# Altium schematic sheet Sheet3.SchDoc
size A4 portrait
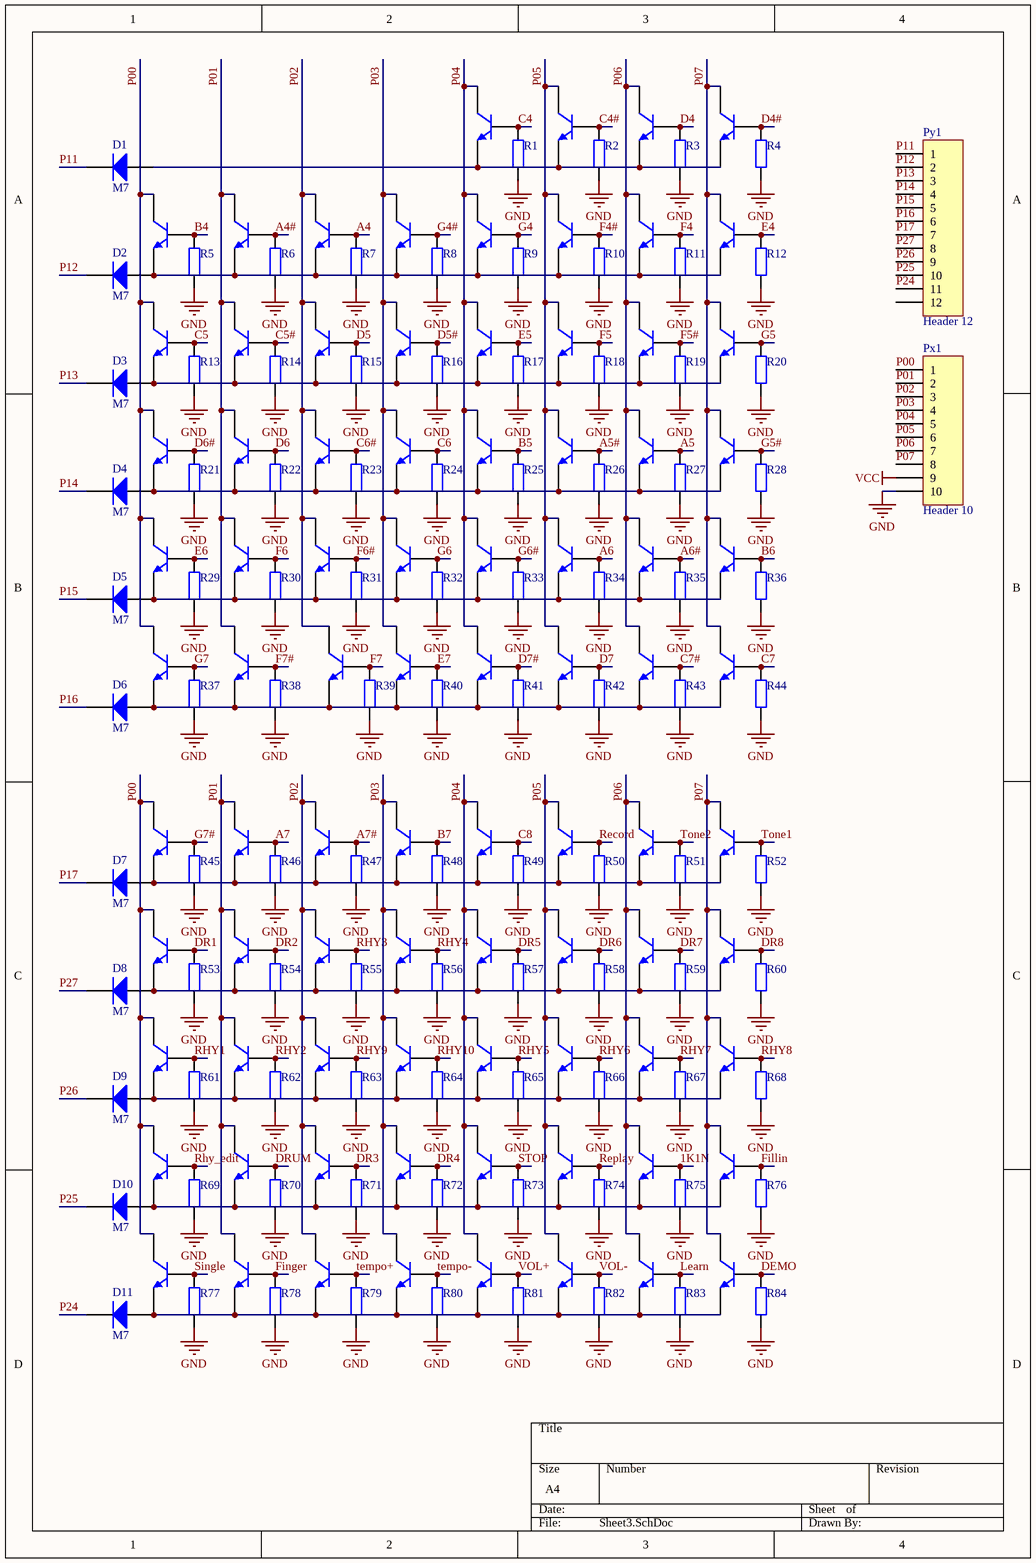
[diagram p0: Sheet3.SchDoc]

## Parts
D1  M7  [SMA(DO-214AC)_S1]
D2  M7  [SMA(DO-214AC)_S1]
D3  M7  [SMA(DO-214AC)_S1]
D4  M7  [SMA(DO-214AC)_S1]
D5  M7  [SMA(DO-214AC)_S1]
D6  M7  [SMA(DO-214AC)_S1]
D7  M7  [SMA(DO-214AC)_S1]
D8  M7  [SMA(DO-214AC)_S1]
D9  M7  [SMA(DO-214AC)_S1]
D10  M7  [SMA(DO-214AC)_S1]
D11  M7  [SMA(DO-214AC)_S1]
Px1  Header 10  [FPC1.0-2H-WS-10P]
Py1  Header 12  [FPC1.0-2H-WS-12P]
Q1  SS8050 Y1  [SOT-23(SOT-23-3)]  (value not drawn)
Q2  SS8050 Y1  [SOT-23(SOT-23-3)]  (value not drawn)
Q3  SS8050 Y1  [SOT-23(SOT-23-3)]  (value not drawn)
Q4  SS8050 Y1  [SOT-23(SOT-23-3)]  (value not drawn)
Q5  SS8050 Y1  [SOT-23(SOT-23-3)]  (value not drawn)
Q6  SS8050 Y1  [SOT-23(SOT-23-3)]  (value not drawn)
Q7  SS8050 Y1  [SOT-23(SOT-23-3)]  (value not drawn)
Q8  SS8050 Y1  [SOT-23(SOT-23-3)]  (value not drawn)
Q9  SS8050 Y1  [SOT-23(SOT-23-3)]  (value not drawn)
Q10  SS8050 Y1  [SOT-23(SOT-23-3)]  (value not drawn)
Q11  SS8050 Y1  [SOT-23(SOT-23-3)]  (value not drawn)
Q12  SS8050 Y1  [SOT-23(SOT-23-3)]  (value not drawn)
Q13  SS8050 Y1  [SOT-23(SOT-23-3)]  (value not drawn)
Q14  SS8050 Y1  [SOT-23(SOT-23-3)]  (value not drawn)
Q15  SS8050 Y1  [SOT-23(SOT-23-3)]  (value not drawn)
Q16  SS8050 Y1  [SOT-23(SOT-23-3)]  (value not drawn)
Q17  SS8050 Y1  [SOT-23(SOT-23-3)]  (value not drawn)
Q18  SS8050 Y1  [SOT-23(SOT-23-3)]  (value not drawn)
Q19  SS8050 Y1  [SOT-23(SOT-23-3)]  (value not drawn)
Q20  SS8050 Y1  [SOT-23(SOT-23-3)]  (value not drawn)
Q21  SS8050 Y1  [SOT-23(SOT-23-3)]  (value not drawn)
Q22  SS8050 Y1  [SOT-23(SOT-23-3)]  (value not drawn)
Q23  SS8050 Y1  [SOT-23(SOT-23-3)]  (value not drawn)
Q24  SS8050 Y1  [SOT-23(SOT-23-3)]  (value not drawn)
Q25  SS8050 Y1  [SOT-23(SOT-23-3)]  (value not drawn)
Q26  SS8050 Y1  [SOT-23(SOT-23-3)]  (value not drawn)
Q27  SS8050 Y1  [SOT-23(SOT-23-3)]  (value not drawn)
Q28  SS8050 Y1  [SOT-23(SOT-23-3)]  (value not drawn)
Q29  SS8050 Y1  [SOT-23(SOT-23-3)]  (value not drawn)
Q30  SS8050 Y1  [SOT-23(SOT-23-3)]  (value not drawn)
Q31  SS8050 Y1  [SOT-23(SOT-23-3)]  (value not drawn)
Q32  SS8050 Y1  [SOT-23(SOT-23-3)]  (value not drawn)
Q33  SS8050 Y1  [SOT-23(SOT-23-3)]  (value not drawn)
Q34  SS8050 Y1  [SOT-23(SOT-23-3)]  (value not drawn)
Q35  SS8050 Y1  [SOT-23(SOT-23-3)]  (value not drawn)
Q36  SS8050 Y1  [SOT-23(SOT-23-3)]  (value not drawn)
Q37  SS8050 Y1  [SOT-23(SOT-23-3)]  (value not drawn)
Q38  SS8050 Y1  [SOT-23(SOT-23-3)]  (value not drawn)
Q39  SS8050 Y1  [SOT-23(SOT-23-3)]  (value not drawn)
Q40  SS8050 Y1  [SOT-23(SOT-23-3)]  (value not drawn)
Q41  SS8050 Y1  [SOT-23(SOT-23-3)]  (value not drawn)
Q42  SS8050 Y1  [SOT-23(SOT-23-3)]  (value not drawn)
Q43  SS8050 Y1  [SOT-23(SOT-23-3)]  (value not drawn)
Q44  SS8050 Y1  [SOT-23(SOT-23-3)]  (value not drawn)
Q45  SS8050 Y1  [SOT-23(SOT-23-3)]  (value not drawn)
Q46  SS8050 Y1  [SOT-23(SOT-23-3)]  (value not drawn)
Q47  SS8050 Y1  [SOT-23(SOT-23-3)]  (value not drawn)
Q48  SS8050 Y1  [SOT-23(SOT-23-3)]  (value not drawn)
Q49  SS8050 Y1  [SOT-23(SOT-23-3)]  (value not drawn)
Q50  SS8050 Y1  [SOT-23(SOT-23-3)]  (value not drawn)
Q51  SS8050 Y1  [SOT-23(SOT-23-3)]  (value not drawn)
Q52  SS8050 Y1  [SOT-23(SOT-23-3)]  (value not drawn)
Q53  SS8050 Y1  [SOT-23(SOT-23-3)]  (value not drawn)
Q54  SS8050 Y1  [SOT-23(SOT-23-3)]  (value not drawn)
Q55  SS8050 Y1  [SOT-23(SOT-23-3)]  (value not drawn)
Q56  SS8050 Y1  [SOT-23(SOT-23-3)]  (value not drawn)
Q57  SS8050 Y1  [SOT-23(SOT-23-3)]  (value not drawn)
Q58  SS8050 Y1  [SOT-23(SOT-23-3)]  (value not drawn)
Q59  SS8050 Y1  [SOT-23(SOT-23-3)]  (value not drawn)
Q60  SS8050 Y1  [SOT-23(SOT-23-3)]  (value not drawn)
Q61  SS8050 Y1  [SOT-23(SOT-23-3)]  (value not drawn)
Q62  SS8050 Y1  [SOT-23(SOT-23-3)]  (value not drawn)
Q63  SS8050 Y1  [SOT-23(SOT-23-3)]  (value not drawn)
Q64  SS8050 Y1  [SOT-23(SOT-23-3)]  (value not drawn)
Q65  SS8050 Y1  [SOT-23(SOT-23-3)]  (value not drawn)
Q66  SS8050 Y1  [SOT-23(SOT-23-3)]  (value not drawn)
Q67  SS8050 Y1  [SOT-23(SOT-23-3)]  (value not drawn)
Q68  SS8050 Y1  [SOT-23(SOT-23-3)]  (value not drawn)
Q69  SS8050 Y1  [SOT-23(SOT-23-3)]  (value not drawn)
Q70  SS8050 Y1  [SOT-23(SOT-23-3)]  (value not drawn)
Q71  SS8050 Y1  [SOT-23(SOT-23-3)]  (value not drawn)
Q72  SS8050 Y1  [SOT-23(SOT-23-3)]  (value not drawn)
Q73  SS8050 Y1  [SOT-23(SOT-23-3)]  (value not drawn)
Q74  SS8050 Y1  [SOT-23(SOT-23-3)]  (value not drawn)
Q75  SS8050 Y1  [SOT-23(SOT-23-3)]  (value not drawn)
Q76  SS8050 Y1  [SOT-23(SOT-23-3)]  (value not drawn)
Q77  SS8050 Y1  [SOT-23(SOT-23-3)]  (value not drawn)
Q78  SS8050 Y1  [SOT-23(SOT-23-3)]  (value not drawn)
Q79  SS8050 Y1  [SOT-23(SOT-23-3)]  (value not drawn)
Q80  SS8050 Y1  [SOT-23(SOT-23-3)]  (value not drawn)
Q81  SS8050 Y1  [SOT-23(SOT-23-3)]  (value not drawn)
Q82  SS8050 Y1  [SOT-23(SOT-23-3)]  (value not drawn)
Q83  SS8050 Y1  [SOT-23(SOT-23-3)]  (value not drawn)
Q84  SS8050 Y1  [SOT-23(SOT-23-3)]  (value not drawn)
R1  10KΩ (1002) ±1%  [0603_R]  (value not drawn)
R2  10KΩ (1002) ±1%  [0603_R]  (value not drawn)
R3  10KΩ (1002) ±1%  [0603_R]  (value not drawn)
R4  10KΩ (1002) ±1%  [0603_R]  (value not drawn)
R5  10KΩ (1002) ±1%  [0603_R]  (value not drawn)
R6  10KΩ (1002) ±1%  [0603_R]  (value not drawn)
R7  10KΩ (1002) ±1%  [0603_R]  (value not drawn)
R8  10KΩ (1002) ±1%  [0603_R]  (value not drawn)
R9  10KΩ (1002) ±1%  [0603_R]  (value not drawn)
R10  10KΩ (1002) ±1%  [0603_R]  (value not drawn)
R11  10KΩ (1002) ±1%  [0603_R]  (value not drawn)
R12  10KΩ (1002) ±1%  [0603_R]  (value not drawn)
R13  10KΩ (1002) ±1%  [0603_R]  (value not drawn)
R14  10KΩ (1002) ±1%  [0603_R]  (value not drawn)
R15  10KΩ (1002) ±1%  [0603_R]  (value not drawn)
R16  10KΩ (1002) ±1%  [0603_R]  (value not drawn)
R17  10KΩ (1002) ±1%  [0603_R]  (value not drawn)
R18  10KΩ (1002) ±1%  [0603_R]  (value not drawn)
R19  10KΩ (1002) ±1%  [0603_R]  (value not drawn)
R20  10KΩ (1002) ±1%  [0603_R]  (value not drawn)
R21  10KΩ (1002) ±1%  [0603_R]  (value not drawn)
R22  10KΩ (1002) ±1%  [0603_R]  (value not drawn)
R23  10KΩ (1002) ±1%  [0603_R]  (value not drawn)
R24  10KΩ (1002) ±1%  [0603_R]  (value not drawn)
R25  10KΩ (1002) ±1%  [0603_R]  (value not drawn)
R26  10KΩ (1002) ±1%  [0603_R]  (value not drawn)
R27  10KΩ (1002) ±1%  [0603_R]  (value not drawn)
R28  10KΩ (1002) ±1%  [0603_R]  (value not drawn)
R29  10KΩ (1002) ±1%  [0603_R]  (value not drawn)
R30  10KΩ (1002) ±1%  [0603_R]  (value not drawn)
R31  10KΩ (1002) ±1%  [0603_R]  (value not drawn)
R32  10KΩ (1002) ±1%  [0603_R]  (value not drawn)
R33  10KΩ (1002) ±1%  [0603_R]  (value not drawn)
R34  10KΩ (1002) ±1%  [0603_R]  (value not drawn)
R35  10KΩ (1002) ±1%  [0603_R]  (value not drawn)
R36  10KΩ (1002) ±1%  [0603_R]  (value not drawn)
R37  10KΩ (1002) ±1%  [0603_R]  (value not drawn)
R38  10KΩ (1002) ±1%  [0603_R]  (value not drawn)
R39  10KΩ (1002) ±1%  [0603_R]  (value not drawn)
R40  10KΩ (1002) ±1%  [0603_R]  (value not drawn)
R41  10KΩ (1002) ±1%  [0603_R]  (value not drawn)
R42  10KΩ (1002) ±1%  [0603_R]  (value not drawn)
R43  10KΩ (1002) ±1%  [0603_R]  (value not drawn)
R44  10KΩ (1002) ±1%  [0603_R]  (value not drawn)
R45  10KΩ (1002) ±1%  [0603_R]  (value not drawn)
R46  10KΩ (1002) ±1%  [0603_R]  (value not drawn)
R47  10KΩ (1002) ±1%  [0603_R]  (value not drawn)
R48  10KΩ (1002) ±1%  [0603_R]  (value not drawn)
R49  10KΩ (1002) ±1%  [0603_R]  (value not drawn)
R50  10KΩ (1002) ±1%  [0603_R]  (value not drawn)
R51  10KΩ (1002) ±1%  [0603_R]  (value not drawn)
R52  10KΩ (1002) ±1%  [0603_R]  (value not drawn)
R53  10KΩ (1002) ±1%  [0603_R]  (value not drawn)
R54  10KΩ (1002) ±1%  [0603_R]  (value not drawn)
R55  10KΩ (1002) ±1%  [0603_R]  (value not drawn)
R56  10KΩ (1002) ±1%  [0603_R]  (value not drawn)
R57  10KΩ (1002) ±1%  [0603_R]  (value not drawn)
R58  10KΩ (1002) ±1%  [0603_R]  (value not drawn)
R59  10KΩ (1002) ±1%  [0603_R]  (value not drawn)
R60  10KΩ (1002) ±1%  [0603_R]  (value not drawn)
R61  10KΩ (1002) ±1%  [0603_R]  (value not drawn)
R62  10KΩ (1002) ±1%  [0603_R]  (value not drawn)
R63  10KΩ (1002) ±1%  [0603_R]  (value not drawn)
R64  10KΩ (1002) ±1%  [0603_R]  (value not drawn)
R65  10KΩ (1002) ±1%  [0603_R]  (value not drawn)
R66  10KΩ (1002) ±1%  [0603_R]  (value not drawn)
R67  10KΩ (1002) ±1%  [0603_R]  (value not drawn)
R68  10KΩ (1002) ±1%  [0603_R]  (value not drawn)
R69  10KΩ (1002) ±1%  [0603_R]  (value not drawn)
R70  10KΩ (1002) ±1%  [0603_R]  (value not drawn)
R71  10KΩ (1002) ±1%  [0603_R]  (value not drawn)
R72  10KΩ (1002) ±1%  [0603_R]  (value not drawn)
R73  10KΩ (1002) ±1%  [0603_R]  (value not drawn)
R74  10KΩ (1002) ±1%  [0603_R]  (value not drawn)
R75  10KΩ (1002) ±1%  [0603_R]  (value not drawn)
R76  10KΩ (1002) ±1%  [0603_R]  (value not drawn)
R77  10KΩ (1002) ±1%  [0603_R]  (value not drawn)
R78  10KΩ (1002) ±1%  [0603_R]  (value not drawn)
R79  10KΩ (1002) ±1%  [0603_R]  (value not drawn)
R80  10KΩ (1002) ±1%  [0603_R]  (value not drawn)
R81  10KΩ (1002) ±1%  [0603_R]  (value not drawn)
R82  10KΩ (1002) ±1%  [0603_R]  (value not drawn)
R83  10KΩ (1002) ±1%  [0603_R]  (value not drawn)
R84  10KΩ (1002) ±1%  [0603_R]  (value not drawn)

## Nets
GND: Px1.10 R1.1 R2.1 R3.1 R4.1 R5.1 R6.1 R7.1 R8.1 R9.1 R10.1 R11.1 R12.1 R13.1 R14.1 R15.1 R16.1 R17.1 R18.1 R19.1 R20.1 R21.1 R22.1 R23.1 R24.1 R25.1 R26.1 R27.1 R28.1 R29.1 R30.1 R31.1 R32.1 R33.1 R34.1 R35.1 R36.1 R37.1 R38.1 R39.1 R40.1 R41.1 R42.1 R43.1 R44.1 R45.1 R46.1 R47.1 R48.1 R49.1 R50.1 R51.1 R52.1 R53.1 R54.1 R55.1 R56.1 R57.1 R58.1 R59.1 R60.1 R61.1 R62.1 R63.1 R64.1 R65.1 R66.1 R67.1 R68.1 R69.1 R70.1 R71.1 R72.1 R73.1 R74.1 R75.1 R76.1 R77.1 R78.1 R79.1 R80.1 R81.1 R82.1 R83.1 R84.1
VCC: Px1.9
1K1N: Q75.1(B) R75.2
A4: Q7.1(B) R7.2
A4#: Q6.1(B) R6.2
A5: Q27.1(B) R27.2
A5#: Q26.1(B) R26.2
A6: Q34.1(B) R34.2
A6#: Q35.1(B) R35.2
A7: Q46.1(B) R46.2
A7#: Q47.1(B) R47.2
B4: Q5.1(B) R5.2
B5: Q25.1(B) R25.2
B6: Q36.1(B) R36.2
B7: Q48.1(B) R48.2
C4: Q1.1(B) R1.2
C4#: Q2.1(B) R2.2
C5: Q13.1(B) R13.2
C5#: Q14.1(B) R14.2
C6: Q24.1(B) R24.2
C6#: Q23.1(B) R23.2
C7: Q44.1(B) R44.2
C7#: Q43.1(B) R43.2
C8: Q49.1(B) R49.2
D4: Q3.1(B) R3.2
D4#: Q4.1(B) R4.2
D5: Q15.1(B) R15.2
D5#: Q16.1(B) R16.2
D6: Q22.1(B) R22.2
D6#: Q21.1(B) R21.2
D7: Q42.1(B) R42.2
D7#: Q41.1(B) R41.2
DEMO: Q84.1(B) R84.2
DR1: Q53.1(B) R53.2
DR2: Q54.1(B) R54.2
DR3: Q71.1(B) R71.2
DR4: Q72.1(B) R72.2
DR5: Q57.1(B) R57.2
DR6: Q58.1(B) R58.2
DR7: Q59.1(B) R59.2
DR8: Q60.1(B) R60.2
DRUM: Q70.1(B) R70.2
E4: Q12.1(B) R12.2
E5: Q17.1(B) R17.2
E6: Q29.1(B) R29.2
E7: Q40.1(B) R40.2
F4: Q11.1(B) R11.2
F4#: Q10.1(B) R10.2
F5: Q18.1(B) R18.2
F5#: Q19.1(B) R19.2
F6: Q30.1(B) R30.2
F6#: Q31.1(B) R31.2
F7: Q39.1(B) R39.2
F7#: Q38.1(B) R38.2
Fillin: Q76.1(B) R76.2
Finger: Q78.1(B) R78.2
G4: Q9.1(B) R9.2
G4#: Q8.1(B) R8.2
G5: Q20.1(B) R20.2
G5#: Q28.1(B) R28.2
G6: Q32.1(B) R32.2
G6#: Q33.1(B) R33.2
G7: Q37.1(B) R37.2
G7#: Q45.1(B) R45.2
Learn: Q83.1(B) R83.2
P00: Px1.1 Q5.3(C) Q13.3(C) Q21.3(C) Q29.3(C) Q37.3(C) Q45.3(C) Q53.3(C) Q61.3(C) Q69.3(C) Q77.3(C)
P01: Px1.2 Q6.3(C) Q14.3(C) Q22.3(C) Q30.3(C) Q38.3(C) Q46.3(C) Q54.3(C) Q62.3(C) Q70.3(C) Q78.3(C)
P02: Px1.3 Q7.3(C) Q15.3(C) Q23.3(C) Q31.3(C) Q39.3(C) Q47.3(C) Q55.3(C) Q63.3(C) Q71.3(C) Q79.3(C)
P03: Px1.4 Q8.3(C) Q16.3(C) Q24.3(C) Q32.3(C) Q40.3(C) Q48.3(C) Q56.3(C) Q64.3(C) Q72.3(C) Q80.3(C)
P04: Px1.5 Q1.3(C) Q9.3(C) Q17.3(C) Q25.3(C) Q33.3(C) Q41.3(C) Q49.3(C) Q57.3(C) Q65.3(C) Q73.3(C) Q81.3(C)
P05: Px1.6 Q2.3(C) Q10.3(C) Q18.3(C) Q26.3(C) Q34.3(C) Q42.3(C) Q50.3(C) Q58.3(C) Q66.3(C) Q74.3(C) Q82.3(C)
P06: Px1.7 Q3.3(C) Q11.3(C) Q19.3(C) Q27.3(C) Q35.3(C) Q43.3(C) Q51.3(C) Q59.3(C) Q67.3(C) Q75.3(C) Q83.3(C)
P07: Px1.8 Q4.3(C) Q12.3(C) Q20.3(C) Q28.3(C) Q36.3(C) Q44.3(C) Q52.3(C) Q60.3(C) Q68.3(C) Q76.3(C) Q84.3(C)
P11: D1.2(K) Py1.1
P12: D2.2(K) Py1.2
P13: D3.2(K) Py1.3
P14: D4.2(K) Py1.4
P15: D5.2(K) Py1.5
P16: D6.2(K) Py1.6
P17: D7.2(K) Py1.7
P24: D11.2(K) Py1.11
P25: D10.2(K) Py1.10
P26: D9.2(K) Py1.9
P27: D8.2(K) Py1.8
Record: Q50.1(B) R50.2
Replay: Q74.1(B) R74.2
RHY1: Q61.1(B) R61.2
RHY2: Q62.1(B) R62.2
RHY3: Q55.1(B) R55.2
RHY4: Q56.1(B) R56.2
RHY5: Q65.1(B) R65.2
RHY6: Q66.1(B) R66.2
RHY7: Q67.1(B) R67.2
RHY8: Q68.1(B) R68.2
RHY9: Q63.1(B) R63.2
RHY10: Q64.1(B) R64.2
Rhy_edit: Q69.1(B) R69.2
Single: Q77.1(B) R77.2
STOP: Q73.1(B) R73.2
tempo+: Q79.1(B) R79.2
tempo-: Q80.1(B) R80.2
Tone1: Q52.1(B) R52.2
Tone2: Q51.1(B) R51.2
VOL+: Q81.1(B) R81.2
VOL-: Q82.1(B) R82.2
NetD1_1: D1.1(A) Q1.2(E) Q2.2(E) Q3.2(E) Q4.2(E)
NetD2_1: D2.1(A) Q5.2(E) Q6.2(E) Q7.2(E) Q8.2(E) Q9.2(E) Q10.2(E) Q11.2(E) Q12.2(E)
NetD3_1: D3.1(A) Q13.2(E) Q14.2(E) Q15.2(E) Q16.2(E) Q17.2(E) Q18.2(E) Q19.2(E) Q20.2(E)
NetD4_1: D4.1(A) Q21.2(E) Q22.2(E) Q23.2(E) Q24.2(E) Q25.2(E) Q26.2(E) Q27.2(E) Q28.2(E)
NetD5_1: D5.1(A) Q29.2(E) Q30.2(E) Q31.2(E) Q32.2(E) Q33.2(E) Q34.2(E) Q35.2(E) Q36.2(E)
NetD6_1: D6.1(A) Q37.2(E) Q38.2(E) Q39.2(E) Q40.2(E) Q41.2(E) Q42.2(E) Q43.2(E) Q44.2(E)
NetD7_1: D7.1(A) Q45.2(E) Q46.2(E) Q47.2(E) Q48.2(E) Q49.2(E) Q50.2(E) Q51.2(E) Q52.2(E)
NetD8_1: D8.1(A) Q53.2(E) Q54.2(E) Q55.2(E) Q56.2(E) Q57.2(E) Q58.2(E) Q59.2(E) Q60.2(E)
NetD9_1: D9.1(A) Q61.2(E) Q62.2(E) Q63.2(E) Q64.2(E) Q65.2(E) Q66.2(E) Q67.2(E) Q68.2(E)
NetD10_1: D10.1(A) Q69.2(E) Q70.2(E) Q71.2(E) Q72.2(E) Q73.2(E) Q74.2(E) Q75.2(E) Q76.2(E)
NetD11_1: D11.1(A) Q77.2(E) Q78.2(E) Q79.2(E) Q80.2(E) Q81.2(E) Q82.2(E) Q83.2(E) Q84.2(E)

Not connected (* = marked no-connect by the designer): Py1 12

## Library data of the parts
D1-D11 = SMA(DO-214AC) M7: 二极管; 备注: 1N4007 4007 编号C2464 已经停售, 使用新物料编号C95872; ComponentLink1Description: 供应商链接; ComponentLink1URL: http://www.szlcsc.com/product/details_2841.html; Package: SMA(DO-214AC); Supplier: LC; SuppliersPartNumber: C95872
Px1 = Header 10: Header, 10-Pin; LatestRevisionDate: 17-Jul-2002; LatestRevisionNote: Re-released for DXP Platform.; Publisher: Altium Limited
Py1 = Header 12: Header, 12-Pin; LatestRevisionDate: 17-Jul-2002; LatestRevisionNote: Re-released for DXP Platform.; Publisher: Altium Limited
Q1-Q84 = SOT-23 SS8050 Y1: 三极管; ComponentLink1Description: 供应商链接; ComponentLink1URL: http://www.szlcsc.com/product/details_2507.html; Package: SOT-23; Supplier: LC; SuppliersPartNumber: C2150
R1-R84 = 0603 10KΩ (1002) 1%: 贴片电阻; ComponentLink1Description: 供应商链接; ComponentLink1URL: http://www.szlcsc.com/product/details_26547.html; Package: 0603; Supplier: LC; SuppliersPartNumber: C25804